# EAGLE schematic groundStation (EAGLE 9.6.2)
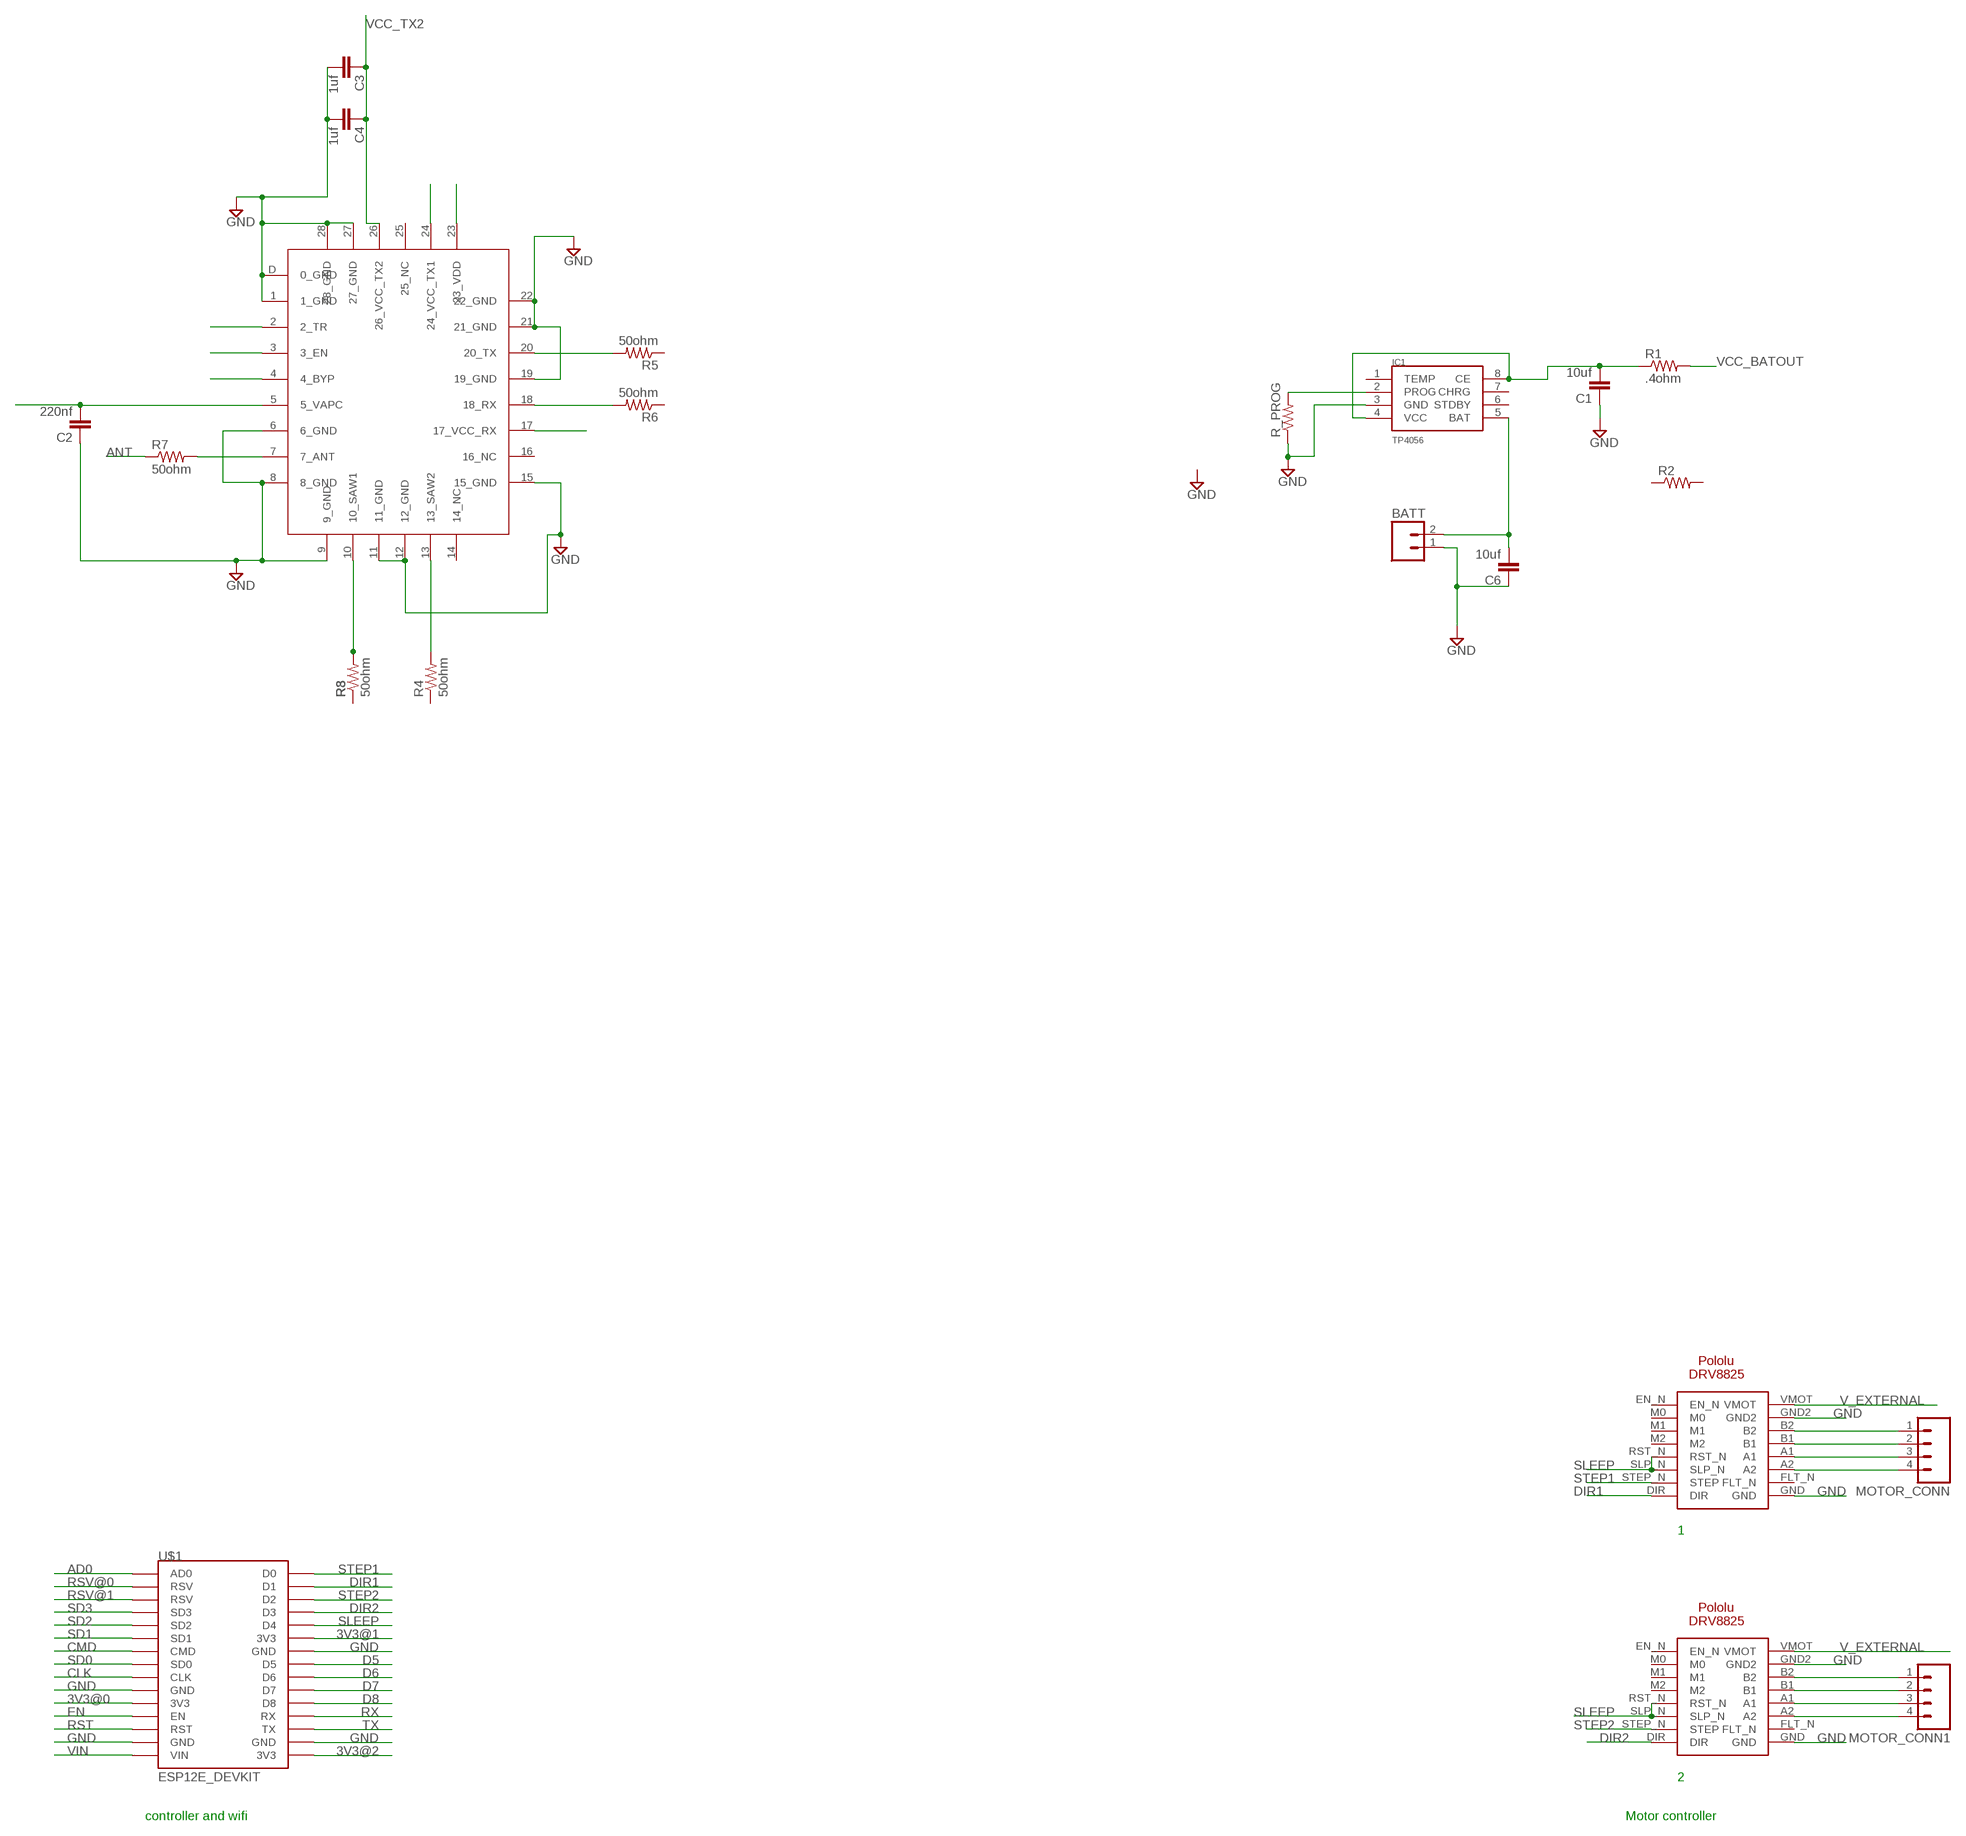
[diagram p0: schematic, sheet 1]

## Parts
BATT  M02  [02P]
C1  10uf  0.1UF-0603-100V-10%  [0603]
C2  220nf  0.1UF-0603-100V-10%  [0603]
C3  1uf  0.1UF-0603-100V-10%  [0603]
C4  1uf  0.1UF-0603-100V-10%  [0603]
C6  10uf  0.1UF-0603-100V-10%  [0603]
IC1  TP4056  [SOP-8]
MOTOR_CONN  M04  [04P]
MOTOR_CONN1  M04  [04P]
R1  .4ohm  R-US_R0603  [R0603]
R2  R-US_R0603  [R0603]
R3  R-US_R0603  [R0603]
R4  50ohm  R-US_R0603  [R0603]
R5  50ohm  R-US_R0603  [R0603]
R6  50ohm  R-US_R0603  [R0603]
R7  50ohm  R-US_R0603  [R0603]
R8  50ohm  R-US_R0603  [R0603]
R_PROG  R-US_R0603  [R0603]
U$1  ESP12E_DEVKIT  [ESP12E_DEVKIT]
U$2  POLOLU-DRV8825  [POLOLU-DRV8825]
U$3  RFFM6404  [RFFM6406]
U$4  POLOLU-DRV8825  [POLOLU-DRV8825]

## Nets
3V3@0: U$1.3V3@0(3V3)
3V3@1: U$1.3V3@1(3V3)
3V3@2: U$1.3V3@2(3V3)
AD0: U$1.AD0
ANT: R7.1
CLK: U$1.CLK
CMD: U$1.CMD
D5: U$1.D5
D6: U$1.D6
D7: U$1.D7
D8: U$1.D8
DIR1: U$1.D1 U$2.DIR
DIR2: U$1.D3 U$4.DIR
EN: U$1.EN
GND: BATT.1 C1.1 C2.1 C3.2 C4.2 C6.1 IC1.3(GND) R_PROG.1 U$1.GND@0(GND) U$1.GND@1(GND) U$1.GND@2(GND) U$1.GND@3(GND) U$2.GND U$2.GND2 U$3.1(1_GND) U$3.6(6_GND) U$3.8(8_GND) U$3.9(9_GND) U$3.11(11_GND) U$3.12(12_GND) U$3.15(15_GND) U$3.19(19_GND) U$3.21(21_GND) U$3.22(22_GND) U$3.27(27_GND) U$3.28(28_GND) U$3.D(0_GND) U$4.GND U$4.GND2
N$1: BATT.2 C6.2 IC1.5(BAT)
N$2: C1.2 IC1.4(VCC) IC1.8(CE) R1.1
N$3: IC1.2(PROG) R_PROG.2
N$4: R3.2 R8.2 U$3.10(10_SAW1)
N$5: MOTOR_CONN.1 U$2.B2
N$6: R3.1 R8.1
N$7: R7.2 U$3.7(7_ANT)
N$8: MOTOR_CONN.2 U$2.B1
N$9: C2.2 U$3.5(5_VAPC)
N$10: MOTOR_CONN.3 U$2.A1
N$11: MOTOR_CONN.4 U$2.A2
N$12: R4.2 U$3.13(13_SAW2)
N$13: R5.2 U$3.20(20_TX)
N$14: R6.2 U$3.18(18_RX)
N$15: U$3.17(17_VCC_RX)
N$16: MOTOR_CONN1.1 U$4.B2
N$17: U$3.23(23_VDD)
N$18: U$3.24(24_VCC_TX1)
N$19: U$3.2(2_TR)
N$20: U$3.3(3_EN)
N$21: U$3.4(4_BYP)
N$42: MOTOR_CONN1.2 U$4.B1
N$43: MOTOR_CONN1.3 U$4.A1
N$44: MOTOR_CONN1.4 U$4.A2
RST: U$1.RST
RSV@0: U$1.RSV@0(RSV)
RSV@1: U$1.RSV@1(RSV)
RX: U$1.RX
SD0: U$1.SD0
SD1: U$1.SD1
SD2: U$1.SD2
SD3: U$1.SD3
SLEEP: U$1.D4 U$2.RST_N U$2.SLP_N U$4.RST_N U$4.SLP_N
STEP1: U$1.D0 U$2.STEP_N(STEP)
STEP2: U$1.D2 U$4.STEP_N(STEP)
TX: U$1.TX
V_EXTERNAL: U$2.VMOT U$4.VMOT
VCC_BATOUT: R1.2
VCC_TX2: C3.1 C4.1 U$3.26(26_VCC_TX2)
VIN: U$1.VIN
Unconnected: IC1.1(TEMP) IC1.6(STDBY) IC1.7(CHRG) R2.1 R2.2 R4.1 R5.1 R6.1 U$2.EN_N U$2.FLT_N U$2.M0 U$2.M1 U$2.M2 U$3.14(14_NC) U$3.16(16_NC) U$3.25(25_NC) U$4.EN_N U$4.FLT_N U$4.M0 U$4.M1 U$4.M2

## Notes on the sheet
- 1
- 2
- controller and wifi | Motor controller

## Library data of the parts
BATT = con-amp-quick:M02: AMP QUICK CONNECTOR; OC_FARNELL: unknown; OC_NEWARK: unknown
C1-C4 C6 = SparkFun-Capacitors:0.1UF: 0.1µF ceramic capacitors A capacitor is a passive two-terminal electrical component used to store electrical energy temporarily in an electric field.; PROD_ID: CAP-08390; VALUE: 0.1uF
IC1 = TP4056:TP4056
MOTOR_CONN MOTOR_CONN1 = con-amp-quick:M04: AMP QUICK CONNECTOR; OC_FARNELL: unknown; OC_NEWARK: unknown
R1-R8 R_PROG = adafruit:R-US_: RESISTOR, American symbol
U$1 = ESP12E_DEVKIT:ESP12E_DEVKIT: ESP12E DEVKIT BOARD
U$2 U$4 = alvarop-lib:POLOLU-DRV8825
U$3 = RFFM6406:RFFM6404